# EasyEDA Pro project ProPrj_Bias-elimination-final.epro

# Schematic Bias-elimination
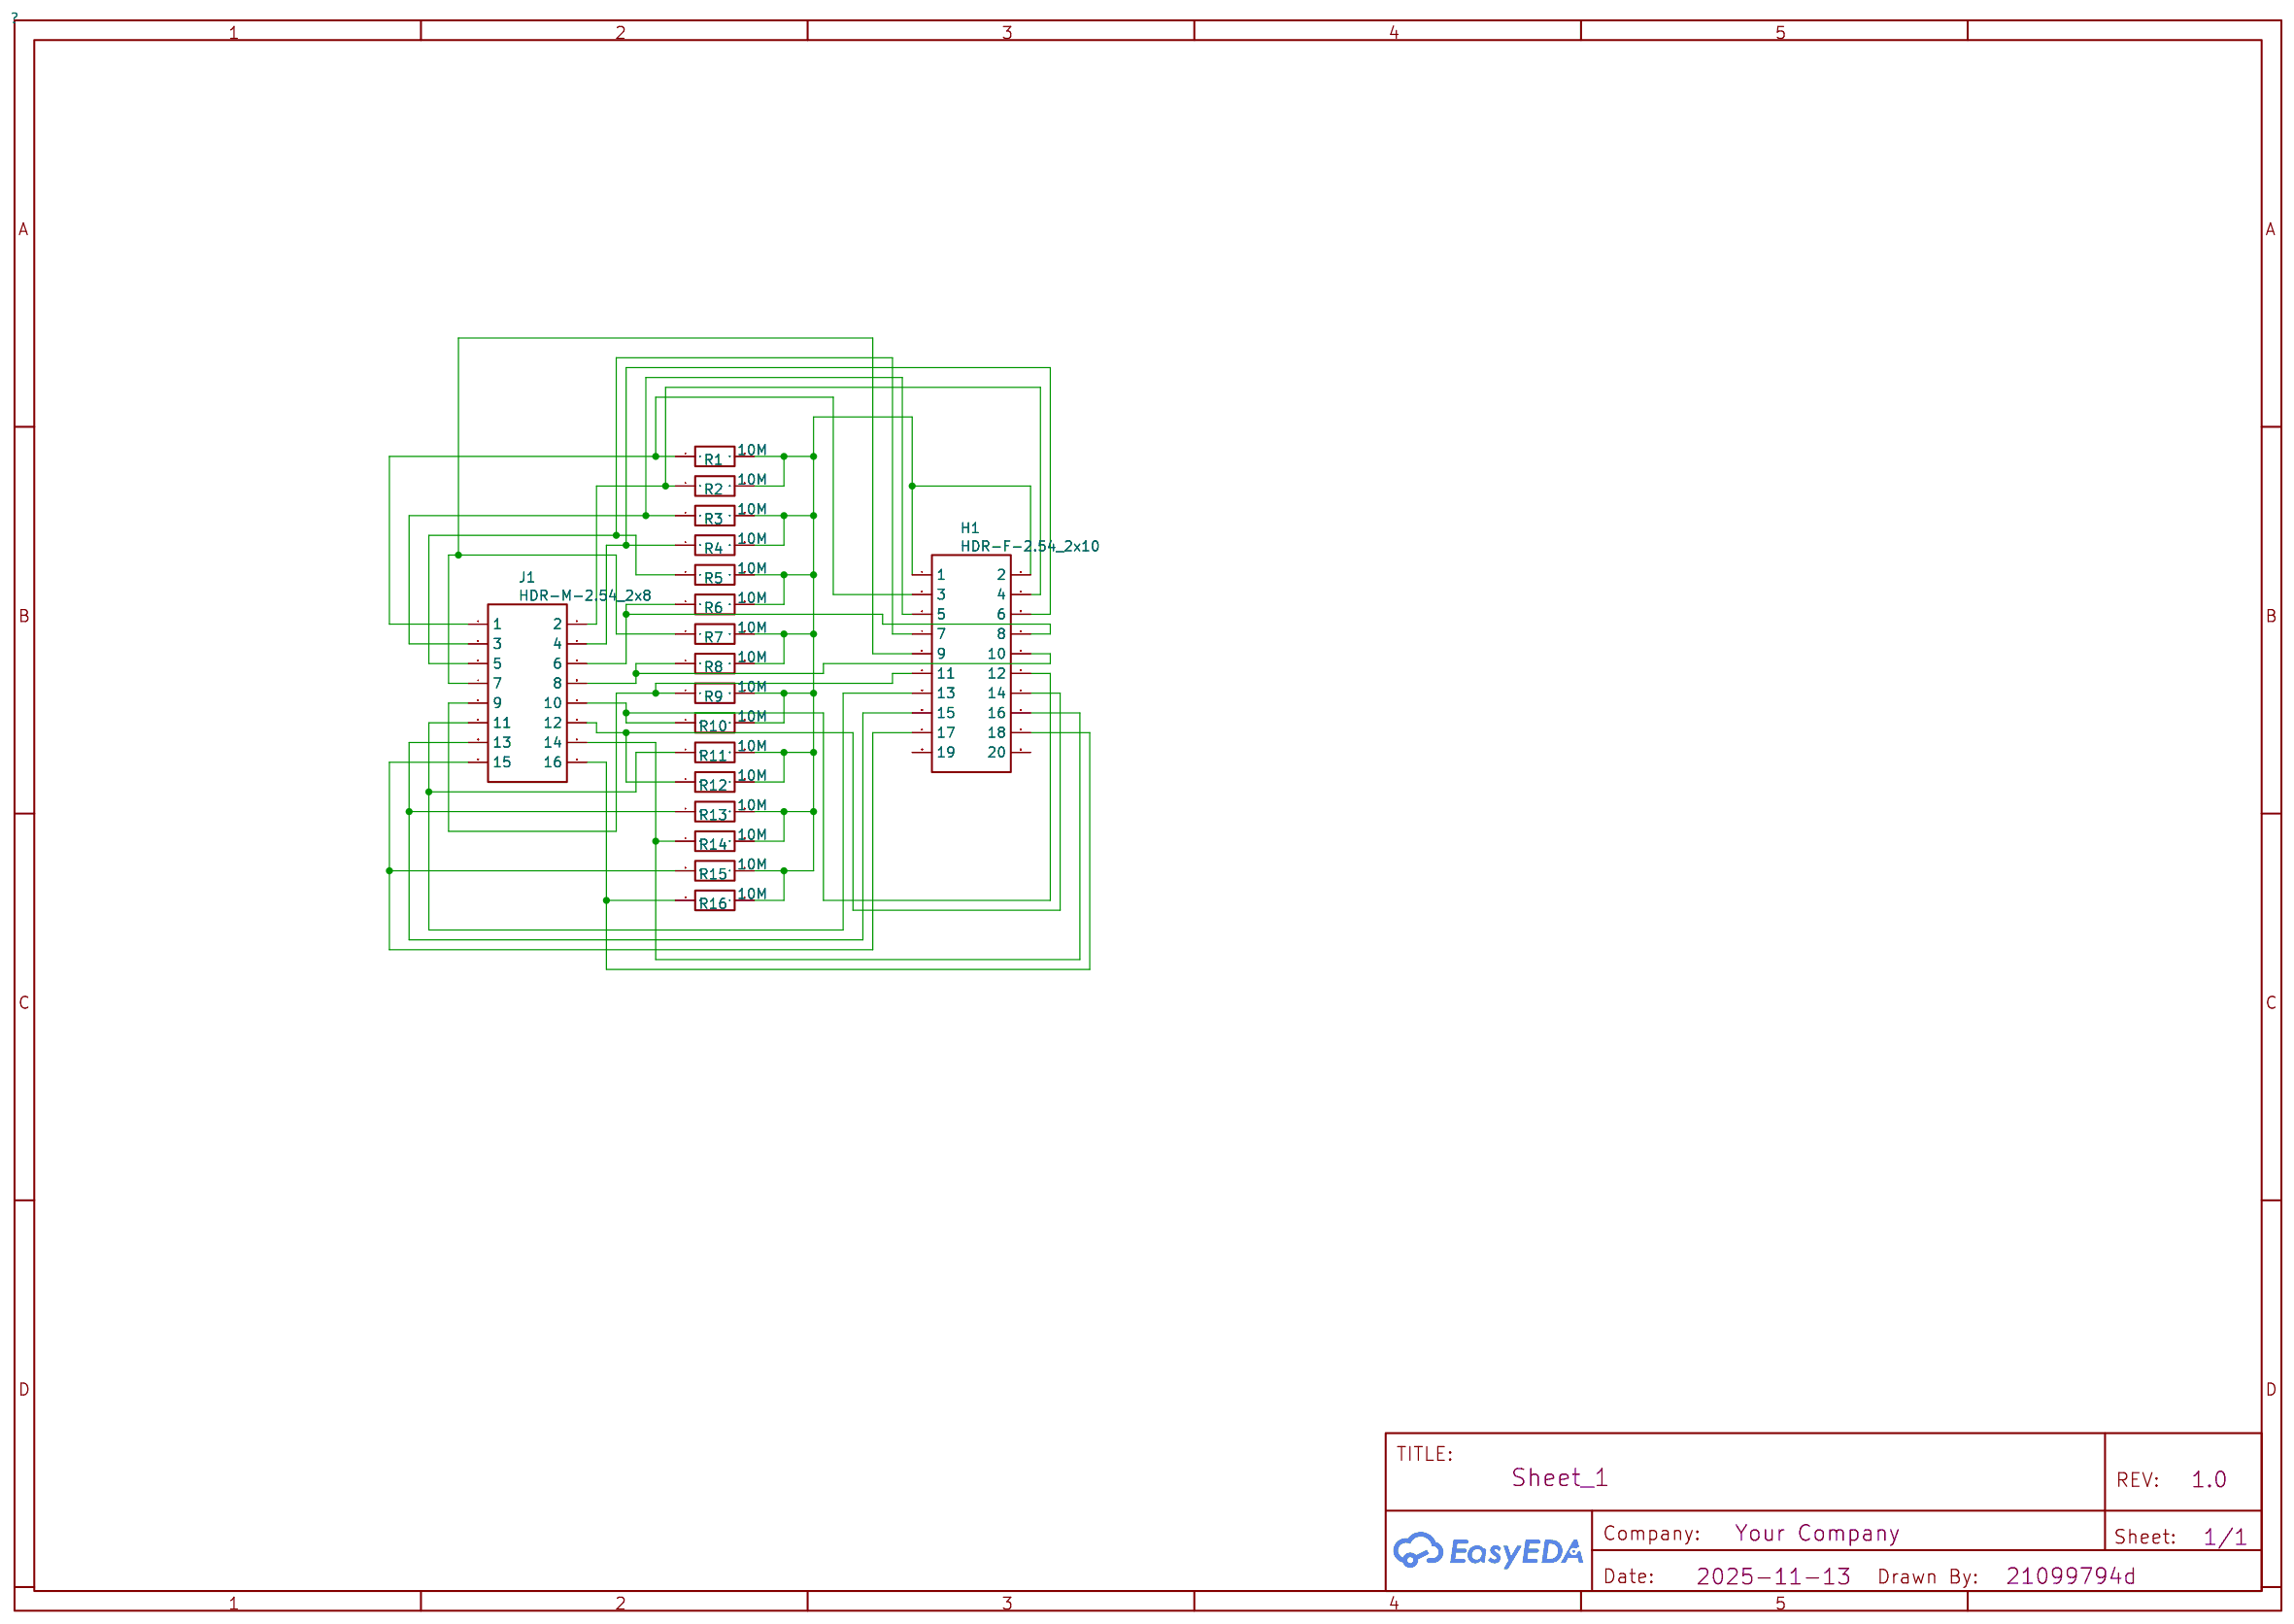
[diagram p0: schematic sheet]

## Parts
H1  HDR-F-2.54_2x10  [HDR-F-2.54_2X10]
J1  HDR-M-2.54_2x8  [HDR-M-2.54_2X8]
R1  10M  [R0603]
R2  10M  [R0603]
R3  10M  [R0603]
R4  10M  [R0603]
R5  10M  [R0603]
R6  10M  [R0603]
R7  10M  [R0603]
R8  10M  [R0603]
R9  10M  [R0603]
R10  10M  [R0603]
R11  10M  [R0603]
R12  10M  [R0603]
R13  10M  [R0603]
R14  10M  [R0603]
R15  10M  [R0603]
R16  10M  [R0603]

## Library data of the parts
H1 = HDR-F-2.54_2x10: Supplier Part: C30867; Supplier: LCSC; Contributor: LCEDA_Lib; spicePre: H
J1 = HDR-M-2.54_2x8: Supplier Part: C68234; Supplier: LCSC; Contributor: LCEDA_Lib; spicePre: J
R1-R16 = 10M: nameAlias: Value(Ω); Contributor: LCEDA_Lib; spicePre: R; spiceSymbolName: R_0603_EU

## Nets
H1_17: H1.17 J1.15 R15.2
R1_1: H1.3 J1.1 R1.1
R1_2: H1.1 H1.2 R1.2 R2.2 R3.2 R4.2 R5.2 R6.2 R7.2 R8.2 R9.2 R10.2 R11.2 R12.2 R13.2 R14.2 R15.1 R16.1
R2_1: H1.4 J1.2 R2.1
R3_1: H1.5 J1.3 R3.1
R4_1: H1.6 J1.4 R4.1
R5_1: H1.7 J1.5 R5.1
R6_1: H1.8 J1.6 R6.1
R7_1: H1.9 J1.7 R7.1
R8_1: H1.10 J1.8 R8.1
R9_1: H1.11 J1.9 R9.1
R10_1: H1.12 J1.10 R10.1
R11_1: H1.13 J1.11 R11.1
R12_1: H1.14 J1.12 R12.1
R13_1: H1.15 J1.13 R13.1
R14_1: H1.16 J1.14 R14.1
R16_2: H1.18 J1.16 R16.2

Not connected (* = marked no-connect by the designer): H1 19 20

# Board 1-PCB_PCB_Bias-elimination
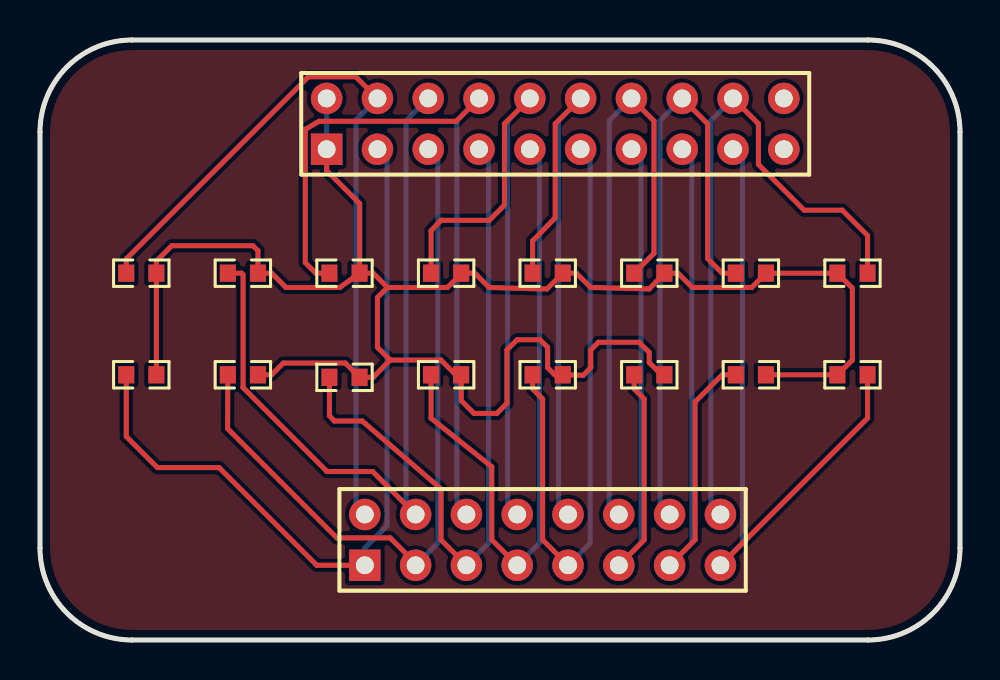
[diagram p1: board, top side]
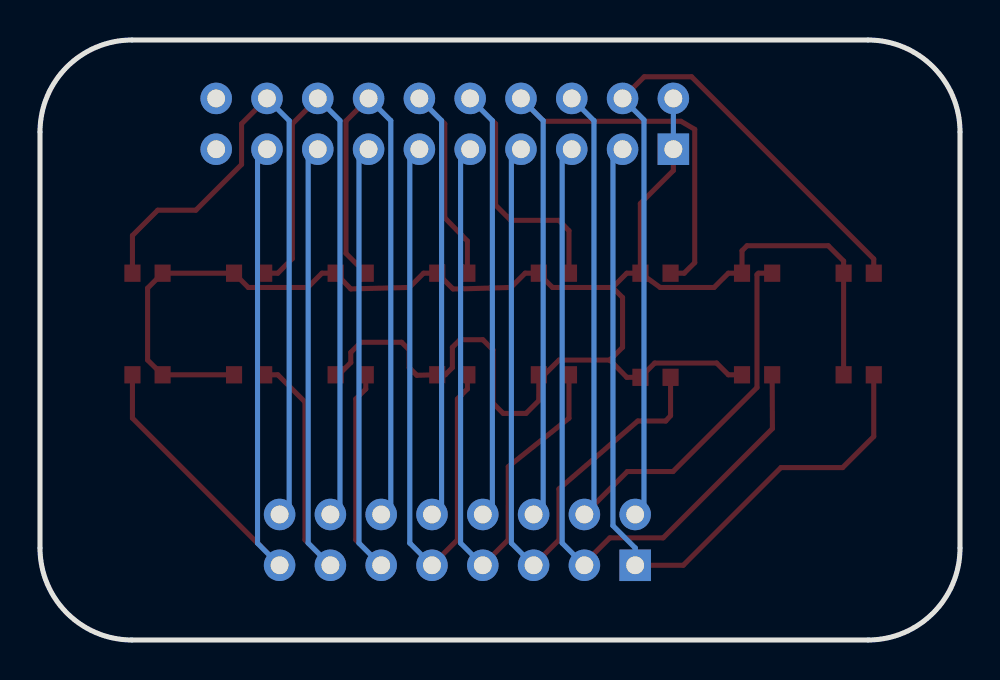
[diagram p2: board, bottom side, seen from below]

Outline 46 x 30 mm; copper layers: Top Layer, Bottom Layer. Coordinates in mm from the lower left corner of the outline.
Outline path: 0,25.4 arc(1.35,28.65) 4.6,30 41.4,30 arc(44.65,28.65) 46,25.4 46,4.6 arc(44.65,1.35) 41.4,0 4.6,0 arc(1.35,1.35) 0,4.6 0,25.4

## Design rules (mm)
via Default (default): diameter min 0.61, default 0.61, max 100.025; hole min 0.305, default 0.305, max 59.995
pour e362 uses gge7147

## Placement (name value [footprint] x y rotation side)
H1  HDR-F-2.54_2x10  [HDR-F-2.54_2X10]  25.76 25.81 0 top
J1  HDR-M-2.54_2x8  [HDR-M-2.54_2X8]  25.13 5.01 0 top
R1  10M  [R0603]  5.07 13.26 0 top
R2  10M  [R0603]  5.07 18.34 0 top
R3  10M  [R0603]  10.15 13.26 0 top
R4  10M  [R0603]  10.15 18.34 0 top
R5  10M  [R0603]  15.23 13.13 0 top
R6  10M  [R0603]  15.23 18.34 0 top
R7  10M  [R0603]  20.31 13.26 0 top
R8  10M  [R0603]  20.31 18.34 0 top
R9  10M  [R0603]  25.39 13.26 0 top
R10  10M  [R0603]  25.39 18.34 0 top
R11  10M  [R0603]  30.47 13.26 0 top
R12  10M  [R0603]  30.47 18.34 0 top
R13  10M  [R0603]  35.55 13.26 0 top
R14  10M  [R0603]  35.55 18.34 0 top
R15  10M  [R0603]  40.63 13.26 0 top
R16  10M  [R0603]  40.63 18.34 0 top

## Footprints (pads in the part's own frame, mm; a bottom-side part is the same pattern mirrored in y, then rotated)
HDR-F-2.54_2X10
  rect 1.575x1.575 hole 0.889: 1(-11.43,-1.27)
  round 1.575 hole 0.889: 2(-11.43,1.27) 3(-8.89,-1.27) 4(-8.89,1.27) 5(-6.35,-1.27) 6(-6.35,1.27) 7(-3.81,-1.27) 8(-3.81,1.27) 9(-1.27,-1.27) 10(-1.27,1.27) 11(1.27,-1.27) 12(1.27,1.27) 13(3.81,-1.27) 14(3.81,1.27) 15(6.35,-1.27) 16(6.35,1.27) 17(8.89,-1.27) 18(8.89,1.27) 19(11.43,-1.27) 20(11.43,1.27)
HDR-M-2.54_2X8
  rect 1.575x1.575 hole 0.889: 1(-8.89,-1.27)
  round 1.575 hole 0.889: 2(-8.89,1.27) 3(-6.35,-1.27) 4(-6.35,1.27) 5(-3.81,-1.27) 6(-3.81,1.27) 7(-1.27,-1.27) 8(-1.27,1.27) 9(1.27,-1.27) 10(1.27,1.27) 11(3.81,-1.27) 12(3.81,1.27) 13(6.35,-1.27) 14(6.35,1.27) 15(8.89,-1.27) 16(8.89,1.27)
R0603
  rect 0.806x0.864 smd: 1(-0.753,0) 2(0.753,0)

## Nets
As in the schematic.

## Routing (per net, layer and track width the routed paths; a pad name or vN(x,y) marks a point on that pad's centre or on a via; arc(x,y) is an arc through that point)
H1_17: length 34
  Top Layer w0.254: 41.38,13.26 41.38,11.09 J1.15
  Bottom Layer w0.254: H1.17 35.13,24.07 35.13,4.84 J1.15
R1_1: length 39.2
  Top Layer w0.254: J1.1 13.84,3.74 8.95,8.62 5.87,8.62 4.31,10.18 4.31,13.26
  Bottom Layer w0.254: H1.3 17.35,24.06 17.35,5.72 16.24,4.6 16.24,3.71
R1_2: length 96.7
  Top Layer w0.254: 39.87,18.34 40.62,17.59 40.62,14 39.87,13.26 ; 15.98,18.34 15.98,21.82 14.33,23.47 H1.1 ; 21.74,18.34 22.46,17.63 25,17.55 25.35,17.55 26.14,18.34 26.82,18.34 27.53,17.63 30.46,17.55 31.22,18.34 31.9,18.34 32.62,17.63 35.59,17.63 36.3,18.34 R16.1 ; 11.58,18.34 10.9,18.34 10.9,19.46 10.65,19.71 6.59,19.71 5.82,18.95 5.82,13.26 ; 17.38,17.63 18.22,17.63 20.38,17.63 21.09,18.34 21.74,18.34 ; 17.38,17.63 16.66,18.34 15.98,18.34 14.99,17.63 12.3,17.63 11.58,18.34 ; 17.38,17.63 16.87,17.13 16.87,14.63 17.5,14 17.5,13.97 ; R15.1 36.3,13.26 ; 31.22,13.26 31.07,13.26 30.46,13.87 30.46,14.38 29.95,14.89 27.92,14.89 27.54,14.51 27.54,13.62 27.16,13.24 26.14,13.26 25.74,13.26 25.38,13.62 25.38,14.63 25,15.01 23.86,15.01 23.35,14.51 23.35,11.84 22.84,11.33 21.7,11.33 21.06,11.97 21.06,13.26 20.78,13.26 20.05,14 17.5,14 16.66,13.13 15.98,13.13 15.27,13.85 12.17,13.85 11.58,13.26 10.9,13.26
  Bottom Layer w0.254: H1.1 H1.2
R2_1: length 38.9
  Top Layer w0.254: R2.1 4.31,19.05 13.42,28.16 15.79,28.16 H1.4
  Bottom Layer w0.254: H1.4 15.8,26.01 15.8,6.72 J1.2
R3_1: length 36.4
  Top Layer w0.254: J1.3 18.78,3.83 17.51,5.11 14.84,5.11 9.38,10.57 9.39,13.26
  Bottom Layer w0.254: J1.3 19.89,4.85 19.89,24.06 H1.5
R4_1: length 39.2
  Top Layer w0.254: R4.1 10.08,18.34 10.15,18.27 10.15,12.62 14.35,8.42 16.63,8.42 J1.4
  Bottom Layer w0.254: J1.4 18.3,6.76 18.3,25.97 H1.6
R5_1: length 34.7
  Top Layer w0.254: J1.5 20.05,5.01 20.05,7.55 16.11,10.95 14.71,10.95 14.47,11.22 R5.1
  Bottom Layer w0.254: H1.7 22.43,24.06 22.43,4.85 J1.5
R6_1: length 38.8
  Top Layer w0.254: H1.8 20.81,25.94 13.95,25.94 13.26,25.53 13.26,18.87 13.79,18.34 R6.1
  Bottom Layer w0.254: H1.8 20.84,25.97 20.84,6.76 J1.6
R7_1: length 33
  Top Layer w0.254: 19.55,13.26 19.55,11.09 22.59,8.66 22.59,5.01 J1.7
  Bottom Layer w0.254: J1.7 24.97,4.85 24.97,24.06 H1.9
R8_1: length 33.7
  Top Layer w0.254: H1.10 23.22,25.81 23.22,21.75 22.46,20.98 20.05,20.98 19.55,20.46 19.55,18.34
  Bottom Layer w0.254: H1.10 23.38,25.97 23.38,6.76 J1.8
R9_1: length 31.7
  Top Layer w0.254: R9.1 24.63,12.55 25.13,12.05 25.13,5.01 J1.9
  Bottom Layer w0.254: H1.11 27.51,24.06 27.51,4.85 J1.9
R10_1: length 31.2
  Top Layer w0.254: 24.63,18.34 24.63,19.95 25.76,21.11 25.76,25.81 H1.12
  Bottom Layer w0.254: H1.12 25.92,25.97 25.92,6.76 J1.10
R11_1: length 31.7
  Top Layer w0.254: J1.11 30.21,5.01 30.21,12.05 29.71,12.55 R11.1
  Bottom Layer w0.254: H1.13 30.05,24.06 30.05,4.85 J1.11
R12_1: length 31.1
  Top Layer w0.254: R12.1 30.7,19.33 30.7,25.95 H1.14
  Bottom Layer w0.254: H1.14 28.46,25.97 28.46,6.76 J1.12
R13_1: length 32.8
  Top Layer w0.254: R13.1 34.11,13.26 32.75,11.9 32.75,5.01 J1.13
  Bottom Layer w0.254: J1.13 32.59,4.85 32.59,24.06 H1.15
R14_1: length 31.7
  Top Layer w0.254: R14.1 34.11,18.34 33.38,19.07 33.38,25.81 H1.16
  Bottom Layer w0.254: H1.16 31,25.97 31,6.76 J1.14
R16_2: length 34.1
  Top Layer w0.254: H1.18 35.92,25.81 35.92,23.78 38.21,21.49 40.11,21.49 41.38,20.23 41.38,18.34
  Bottom Layer w0.254: J1.16 33.54,6.76 33.54,25.97 H1.18

## Copper pours and planes (outline as drawn; the poured copper is in the pictures)
GND on Top Layer: -3.07,32.92 -2.94,33.05 51.8,33.05 52.94,31.91 52.94,-1.75 52.81,-1.62 -3.07,-1.62

# Board 2-PCB_PCB_Bias-elimination_2
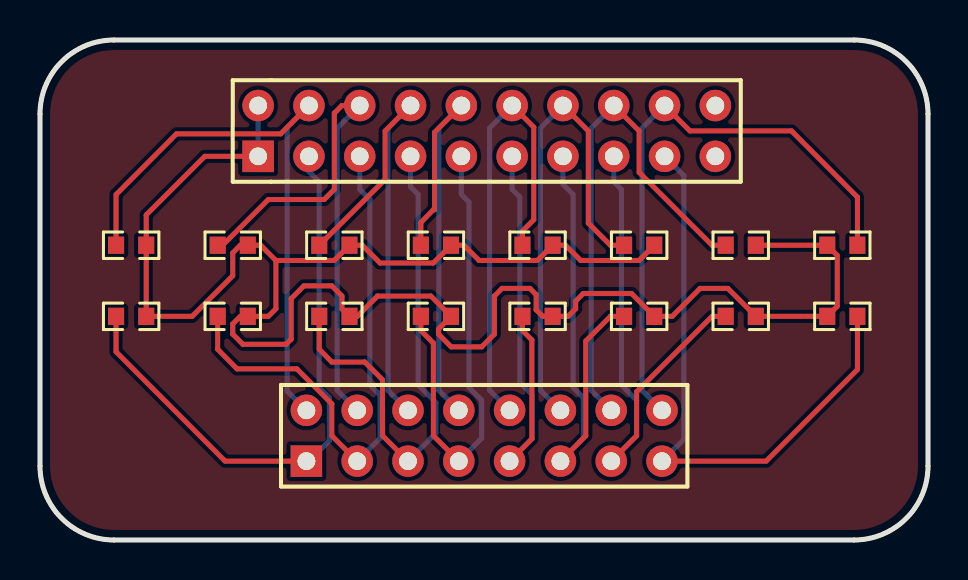
[diagram p3: board, top side]
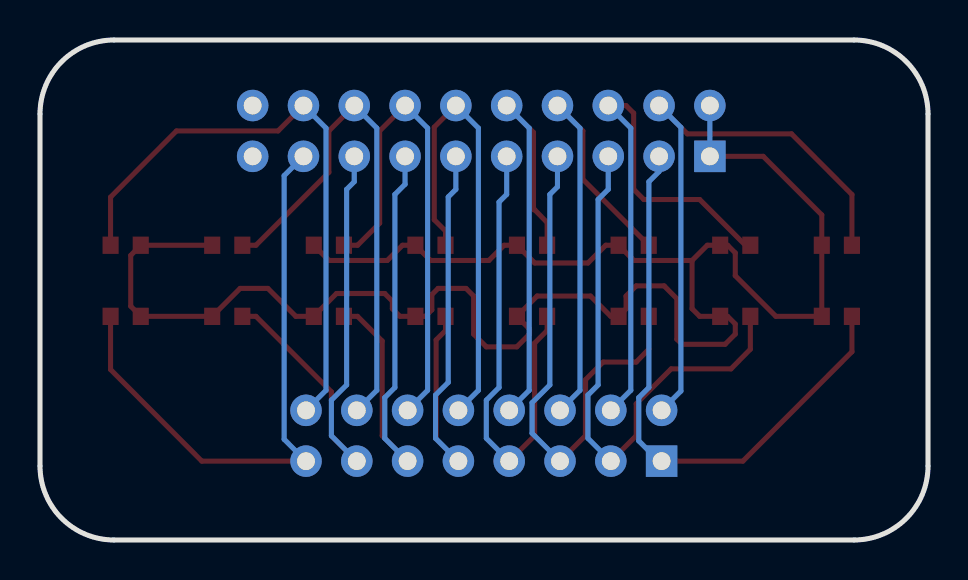
[diagram p4: board, bottom side, seen from below]

Outline 44.4 x 25 mm; copper layers: Top Layer, Bottom Layer. Coordinates in mm from the lower left corner of the outline.
Outline path: 0,21.3 arc(1.08,23.92) 3.7,25 40.7,25 arc(43.32,23.92) 44.4,21.3 44.4,3.7 arc(43.32,1.08) 40.7,0 3.7,0 arc(1.08,1.08) 0,3.7 0,21.3

## Design rules (mm)
via Default (default): diameter min 0.61, default 0.61, max 100.025; hole min 0.305, default 0.305, max 59.995
pour e380 uses gge3086

## Placement (name value [footprint] x y rotation side)
H1  HDR-F-2.54_2x10  [HDR-F-2.54_2X10]  22.34 20.45 0 top
J1  HDR-M-2.54_2x8  [HDR-M-2.54_2X8]  22.21 5.21 0 top
R1  10M  [R0603]  4.56 11.18 0 top
R2  10M  [R0603]  4.56 14.74 0 top
R3  10M  [R0603]  9.64 11.18 0 top
R4  10M  [R0603]  9.64 14.74 0 top
R5  10M  [R0603]  14.72 11.18 0 top
R6  10M  [R0603]  14.72 14.74 0 top
R7  10M  [R0603]  19.8 11.18 0 top
R8  10M  [R0603]  19.8 14.74 0 top
R9  10M  [R0603]  24.88 11.18 0 top
R10  10M  [R0603]  24.88 14.74 0 top
R11  10M  [R0603]  29.96 11.18 0 top
R12  10M  [R0603]  29.96 14.74 0 top
R13  10M  [R0603]  35.04 11.18 0 top
R14  10M  [R0603]  35.04 14.74 0 top
R15  10M  [R0603]  40.12 11.18 0 top
R16  10M  [R0603]  40.12 14.74 0 top

## Footprints (pads in the part's own frame, mm; a bottom-side part is the same pattern mirrored in y, then rotated)
HDR-F-2.54_2X10
  rect 1.575x1.575 hole 0.889: 1(-11.43,-1.27)
  round 1.575 hole 0.889: 2(-11.43,1.27) 3(-8.89,-1.27) 4(-8.89,1.27) 5(-6.35,-1.27) 6(-6.35,1.27) 7(-3.81,-1.27) 8(-3.81,1.27) 9(-1.27,-1.27) 10(-1.27,1.27) 11(1.27,-1.27) 12(1.27,1.27) 13(3.81,-1.27) 14(3.81,1.27) 15(6.35,-1.27) 16(6.35,1.27) 17(8.89,-1.27) 18(8.89,1.27) 19(11.43,-1.27) 20(11.43,1.27)
HDR-M-2.54_2X8
  rect 1.575x1.575 hole 0.889: 1(-8.89,-1.27)
  round 1.575 hole 0.889: 2(-8.89,1.27) 3(-6.35,-1.27) 4(-6.35,1.27) 5(-3.81,-1.27) 6(-3.81,1.27) 7(-1.27,-1.27) 8(-1.27,1.27) 9(1.27,-1.27) 10(1.27,1.27) 11(3.81,-1.27) 12(3.81,1.27) 13(6.35,-1.27) 14(6.35,1.27) 15(8.89,-1.27) 16(8.89,1.27)
R0603
  rect 0.806x0.864 smd: 1(-0.753,0) 2(0.753,0)

## Nets
H1_17: H1.17 J1.15 R15.2
H1_19: H1.19
H1_20: H1.20
R1_1: H1.3 J1.1 R1.1
R1_2: H1.1 H1.2 R1.2 R2.2 R3.2 R4.2 R5.2 R6.2 R7.2 R8.2 R9.2 R10.2 R11.2 R12.2 R13.2 R14.2 R15.1 R16.1
R2_1: H1.4 J1.2 R2.1
R3_1: H1.5 J1.3 R3.1
R4_1: H1.6 J1.4 R4.1
R5_1: H1.7 J1.5 R5.1
R6_1: H1.8 J1.6 R6.1
R7_1: H1.9 J1.7 R7.1
R8_1: H1.10 J1.8 R8.1
R9_1: H1.11 J1.9 R9.1
R10_1: H1.12 J1.10 R10.1
R11_1: H1.13 J1.11 R11.1
R12_1: H1.14 J1.12 R12.1
R13_1: H1.15 J1.13 R13.1
R14_1: H1.16 J1.14 R14.1
R16_2: H1.18 J1.16 R16.2

## Routing (per net, layer and track width the routed paths; a pad name or vN(x,y) marks a point on that pad's centre or on a via; arc(x,y) is an arc through that point)
H1_17: length 30.4
  Top Layer w0.254: J1.15 36.31,3.94 40.87,8.52 40.87,11.18
  Bottom Layer w0.254: J1.15 32.19,5.04 32.19,18.22 31.23,19.18
R1_1: length 29.8
  Top Layer w0.254: 3.8,11.18 3.8,9.41 9.26,3.94 J1.1
  Bottom Layer w0.254: H1.3 13.45,18.42 13.96,17.91 13.96,7.63 14.46,7.12 14.46,4.96 13.45,3.94 J1.1
R1_2: length 99.4
  Top Layer w0.254: R5.2 15.1,11.55 15.1,12.2 14.59,12.71 13.19,12.71 12.56,12.07 12.56,10.04 12.3,9.78 10.15,9.78 9.64,10.29 9.64,10.8 10.02,11.18 R3.2 11.41,11.18 11.8,11.56 11.8,13.98 ; 30.71,11.18 29.58,12.33 27.16,12.33 26.78,11.94 26.78,11.56 26.4,11.18 25.13,11.18 24.81,11.5 24.81,12.27 24.5,12.58 23.1,12.58 22.72,12.2 22.72,10.29 22.08,9.66 20.56,9.66 19.92,10.29 19.92,10.55 20.55,11.18 19.54,12.2 16.88,12.2 15.86,11.18 15.47,11.18 ; 39.36,11.18 39.86,11.69 39.86,14.23 39.36,14.74 ; 10.91,19.18 8.24,19.18 5.31,16.25 R2.2 R1.2 7.6,11.18 9.64,13.21 9.64,14.36 10.02,14.74 R4.2 11.03,14.74 11.8,13.98 ; R12.2 29.95,13.98 27.04,13.98 26.27,14.74 R10.2 24.87,13.98 21.96,13.98 21.19,14.74 R8.2 19.66,13.85 17,13.85 16.11,14.74 R6.2 14.71,13.98 11.8,13.98 ; R11.2 31.61,11.18 33,12.58 34.39,12.58 R13.2 R15.1 ; R16.1 R14.2
  Bottom Layer w0.254: 10.91,19.18 10.91,21.72
R2_1: length 30.1
  Top Layer w0.254: H1.4 12.03,20.31 6.82,20.31 3.8,17.27 3.8,14.74
  Bottom Layer w0.254: H1.4 12.35,20.63 12.35,7.45 13.32,6.48
R3_1: length 28
  Top Layer w0.254: 8.88,11.18 8.88,9.54 9.85,8.56 12.84,8.56 14.59,6.81 14.59,5.21 J1.3
  Bottom Layer w0.254: H1.5 15.99,17.53 16.5,17.02 16.5,7.75 17,7.25 17,5.09 J1.3
R4_1: length 28.3
  Top Layer w0.254: H1.6 15.1,21.72 14.72,21.34 14.72,17.53 14.21,17.02 11.41,17.02 9.13,14.74 R4.1
  Bottom Layer w0.254: 15.86,6.48 14.86,7.48 14.86,20.6 H1.6
R5_1: length 26.4
  Top Layer w0.254: 13.96,11.18 13.96,9.54 14.59,8.9 16.24,8.9 17.12,8.01 17.13,5.21 J1.5
  Bottom Layer w0.254: J1.5 19.8,5.34 19.8,6.86 18.91,7.75 18.91,17.28 18.53,17.66 H1.7
R6_1: length 25
  Top Layer w0.254: R6.1 17.26,18.03 17.26,20.45 H1.8
  Bottom Layer w0.254: H1.8 17.4,20.6 17.4,7.48 18.4,6.48
R7_1: length 24.2
  Top Layer w0.254: J1.7 19.67,5.21 19.67,9.84 19.04,10.47 R7.1
  Bottom Layer w0.254: 21.07,19.18 21.07,17.28 21.45,16.9 21.45,7.63 22.08,6.99 22.08,5.09 J1.7
R8_1: length 24
  Top Layer w0.254: 19.04,14.74 19.04,15.87 19.67,16.52 19.73,16.52 19.73,20.38 21.07,21.72
  Bottom Layer w0.254: 20.94,6.48 19.94,7.48 19.94,20.6 21.07,21.72
R9_1: length 24
  Top Layer w0.254: R9.1 24.12,10.47 24.59,10 24.59,5.06 J1.9
  Bottom Layer w0.254: J1.9 24.62,5.09 24.62,7.25 23.99,7.88 23.99,17.15 23.61,17.53 H1.11
R10_1: length 23.8
  Top Layer w0.254: R10.1 24.12,15.45 24.69,16.01 24.69,20.64 H1.12
  Bottom Layer w0.254: H1.12 22.48,20.6 22.48,7.48 23.48,6.48
R11_1: length 25.1
  Top Layer w0.254: R11.1 28.52,11.18 27.29,9.95 27.29,5.21 J1.11
  Bottom Layer w0.254: H1.13 26.15,17.79 26.66,17.28 26.66,7.63 27.16,7.12 27.16,5.09 J1.11
R12_1: length 24.8
  Top Layer w0.254: H1.14 27.42,20.45 27.42,15.84 28.52,14.74 R12.1
  Bottom Layer w0.254: H1.14 25.02,20.6 25.02,7.48 26.02,6.48
R13_1: length 26.2
  Top Layer w0.254: R13.1 33.6,11.18 29.83,7.41 29.83,5.21 J1.13
  Bottom Layer w0.254: 28.69,19.18 28.69,17.91 29.07,17.53 29.07,7.75 29.83,6.99 29.83,5.21 J1.13
R14_1: length 25.8
  Top Layer w0.254: R14.1 33.6,14.74 29.96,18.38 29.96,20.45 28.69,21.72
  Bottom Layer w0.254: 28.56,6.48 27.56,7.48 27.56,20.6 28.69,21.72
R16_2: length 30.1
  Top Layer w0.254: 31.23,21.72 32.5,20.45 37.58,20.45 40.87,17.14 40.87,14.74
  Bottom Layer w0.254: 31.1,6.48 30.1,7.48 30.1,20.6 31.23,21.72

## Copper pours and planes (outline as drawn; the poured copper is in the pictures)
GND on Top Layer: -4.33,25.53 48.75,25.53 49.01,25.28 49.01,-2.53 48.88,-2.41 -4.33,-2.41 -4.33,-2.03 -4.59,-1.77 -4.59,12.71
